# Altium schematic sheet Contact_Sense_Board.SchDoc
size A4
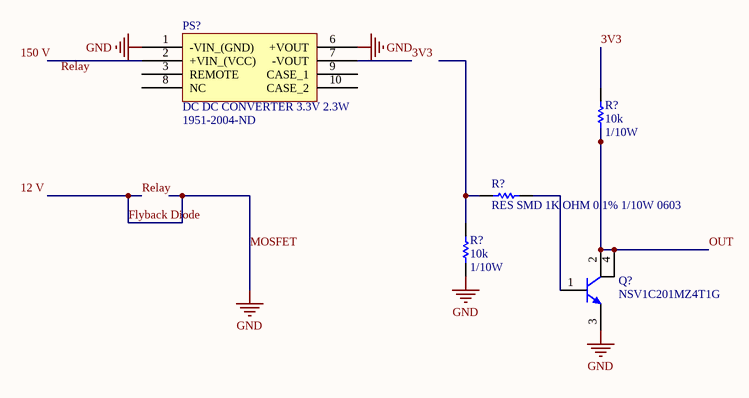
[diagram p0: Contact_Sense_Board.SchDoc]

## Parts
(Parts that share a designator on the sheet are numbered #1, #2 ... from top to bottom, then left to right.)
PS?  DC DC CONVERTER 3.3V 2.3W  Supplier Part Number 1: 1951-2004-ND  [DC DC CONVERTER 3.3V 2.3W]
Q?  NSV1C201MZ4T1G  [BJT NPN 100V 2A SOT223]
R?#1  Resistance: 10k  Power: 1/10W  [RES, 0603]  (hidden comment: RES 10K OHM 1% 1/10W 0603)
R?#2  RES SMD 1K OHM 0.1% 1/10W 0603  [RES, 0603]
R?#3  Resistance: 10k  Power: 1/10W  [RES, 0603]  (hidden comment: RES 10K OHM 1% 1/10W 0603)

## Nets
Flyback Diode: PS?.1(-VIN_(GND)) PS?.6(+VOUT) Q?.3(E) R?#3.2  [also labelled GND, MOSFET, Relay]
3V3: PS?.7(-VOUT) R?#1.1
OUT: Q?.2(C) Q?.4(C) R?#1.2
NetQ?_1: Q?.1(B) R?#2.2
NetR?#2_1: R?#2.1 R?#3.1

Not connected (* = marked no-connect by the designer): PS? 2(+VIN_(VCC)) 3(REMOTE) 8(NC) 9(CASE_1) 10(CASE_2)

## Notes on the sheet
- Labels drawn without touching a wire or pin: 12 V, 150 V, Relay

## Library data of the parts
PS? = DC DC CONVERTER 3.3V 2.3W: Isolated Module DC DC Converter 1 Output 3.3V 700mA 43V - 160V Input; Manufacturer: Traco Power; Manufacturer Part Number: TMR3-7210WIR; Supplier 1: Digi-Key; RoHS: No; Stock 1: 10; Pricing 1: 1=26.80000, 10=24.73600, 25=24.34960, 50=23.19000, 100=21.25750, 250=20.87100, 500=18.55200 (USD)
Q? = BJT NPN 100V 2A SOT223: Bipolar (BJT) Transistor NPN 100V 2A 100MHz 800mW Surface Mount SOT-223 (TO-261); Manufacturer: ON Semiconductor; Vce Saturation (Max) @ Ib, Ic: 180mV @ 200mA, 2A; Current - Collector Cutoff (Max): 100nA (ICBO); DC Current Gain (hFE) (Min) @ Ic, Vce: 120 @ 500mA, 2V; Supplier 1: Digi-Key; Manufacturer Part Number: NSV1C201MZ4T1G; RoHS: RoHS Compliant; Category: Discrete Semiconductor Products; Stock 1: 2000; Pricing 1: 1=0.97, 10=0.825, 100=0.6158, 500=0.48386 (CAD); Packaging: Cut Tape (CT); Part Status: Active; Transistor Type: NPN; Frequency - Transition: 100MHz; Operating Temperature: -55°C ~ 150°C (TJ); Mounting Type: Surface Mount; Package / Case: TO-261-4, TO-261AA; Supplier Device Package: SOT-223 (TO-261); ComponentLink1URL: http://www.onsemi.com/pub/Collateral/NSS1C201MZ4-D.PDF; ComponentLink1Description: http://www.onsemi.com/pub/Collateral/NSS1C201MZ4-D.PDF; Supplier Part Number 1: NSV1C201MZ4T1GOSCT-ND
R?#1 R?#3 = RES 10K OHM 1% 1/10W 0603: RES SMD 10K OHM 1% 1/10W 0603; Manufacturer 1: Yageo; Manufacturer Part Number 1: RC0603FR-0710KL; Temperature Coefficient: ±100ppm/°C; Supplier 1: Digi-Key; Supplier Part Number 1: 311-10.0KHRCT-ND; Packaging: Cut Tape (CT); Part Status: Active; Composition: Thick Film; Operating Temperature: -55°C ~ 155°C; Package / Case: 0603 (1608 Metric); Supplier Device Package: 0603; Size / Dimension: 0.063" L x 0.031" W (1.60mm x 0.80mm); Height - Seated (Max): 0.022" (0.55mm); Failure Rate: -; ComponentLink1URL: http://www.yageo.com/documents/recent/PYu-RC_Group_51_RoHS_L_7.pdf; ComponentLink1Description: http://www.yageo.com/documents/recent/PYu-RC_Group_51_RoHS_L_7.pdf; Tolerance: ±1%
R?#2 = RES SMD 1K OHM 0.1% 1/10W 0603: 1 kOhms ±0.1% 0.1W, 1/10W Chip Resistor 0603 (1608 Metric) Automotive AEC-Q200 Thin Film; Manufacturer: Panasonic; Manufacturer Part Number: ERA3AEB103V; Resistance: 10kR; Power Rating: 100mW; Voltage Rating: 75V; Temperature Coefficient: 25ppm/°C; ComponentLink1Description: Digikey; ComponentLink1URL: https://www.digikey.ca/product-detail/en/panasonic-electronic-components/ERA-3AEB102V/P1.0KDBCT-ND/1466052; Supplier 1: Digi-Key; RoHS: Yes; Stock 1: 2747820; Pricing 1: 1 = 0.35000, 10 = 0.30000, 100 = 0.11720, 1000 = 0.04906, 2500 = 0.04498 (USD); Mount: Surface Mount; Case/Package: 0603; Number of Pins: 2; Case Code (Metric): 1608; Case Code (Imperial): 0603; Contact Plating: Tin; Min Operating Temperature: -55°C; Max Operating Temperature: 155°C; Packaging: Tape and Reel; Tolerance: 0.1%; Package Quantity: 5000; Composition: Metal Film,Thin Film; Number of Terminations: 2; Termination: SMD/SMT; Military Standard: Not; Max Power Dissipation: 100mW; Voltage Rating (DC): 75V; Length: 1.6mm; Height: 0.45mm; Width: 0.8mm; Depth: 0.8mm; Radiation Hardening: No; REACH SVHC: No SVHC; Lead Free: Lead Free; ComponentLink2URL: http://www.farnell.com/datasheets/485442.pdf; ComponentLink2Description: http://www.farnell.com/datasheets/485442.pdf; ComponentLink3URL: http://industrial.panasonic.com/www-data/pdf/AOA0000/AOA0000CE26.pdf; ComponentLink3Description: http://industrial.panasonic.com/www-data/pdf/AOA0000/AOA0000CE26.pdf; ComponentLink4URL: http://www.farnell.com/datasheets/2052875.pdf; ComponentLink4Description: http://www.farnell.com/datasheets/2052875.pdf; ComponentLink5URL: http://www.farnell.com/datasheets/1776116.pdf; ComponentLink5Description: http://www.farnell.com/datasheets/1776116.pdf; ComponentLink6URL: http://uk.rs-online.com/webdocs/148c/0900766b8148c4ab.pdf; ComponentLink6Description: http://uk.rs-online.com/webdocs/148c/0900766b8148c4ab.pdf; ComponentLink7URL: http://www.farnell.com/datasheets/2059650.pdf; ComponentLink7Description: http://www.farnell.com/datasheets/2059650.pdf; ComponentLink8URL: http://www.produktinfo.conrad.com/datenblaetter/450000-474999/451250-da-01-en-WIDERSTAND_0603_ERA.pdf; ComponentLink8Description: http://www.produktinfo.conrad.com/datenblaetter/450000-474999/451250-da-01-en-WIDERSTAND_0603_ERA.pdf; Supplier Part Number 1: P10KDBCT-ND